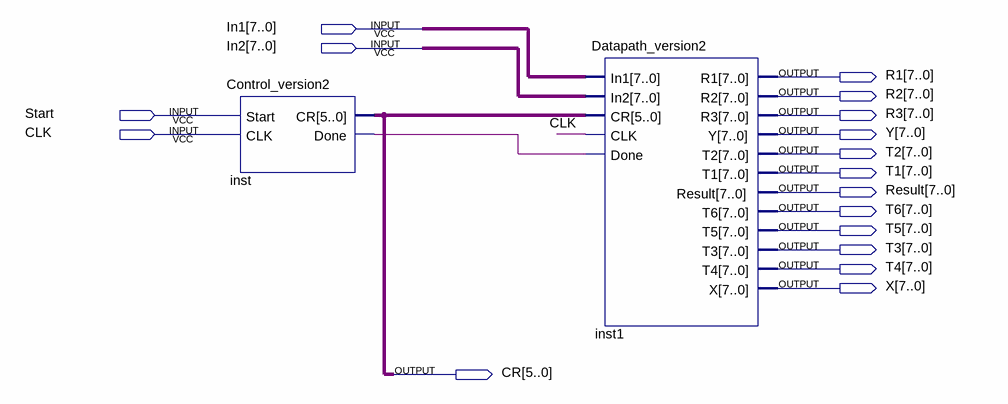
[diagram p0: schematic sheet]
// Quartus schematic version2.bdf as structural Verilog: 2 symbols, 17 pins
module version2 (
  input  [7:0] In1,
  input  [7:0] In2,
  input  Start,
  input  CLK,
  output [7:0] R1,
  output [7:0] R2,
  output [7:0] R3,
  output [7:0] Y,
  output [7:0] T2,
  output [7:0] T1,
  output [7:0] Result,
  output [7:0] T6,
  output [7:0] T5,
  output [7:0] T3,
  output [7:0] T4,
  output [7:0] X,
  output [5:0] CR
);

  wire inst_done;

  Control_version2 inst (.Start(Start), .CLK(CLK), .CR(CR), .Done(inst_done));
  Datapath_version2 inst1 (
    .In1(In1), .In2(In2), .CR(CR), .CLK(CLK), .Done(inst_done), .R1(R1), .R2(R2), .R3(R3), .Y(Y), .T2(T2),
    .T1(T1), .Result(Result), .T6(T6), .T5(T5), .T3(T3), .T4(T4), .X(X));
endmodule
